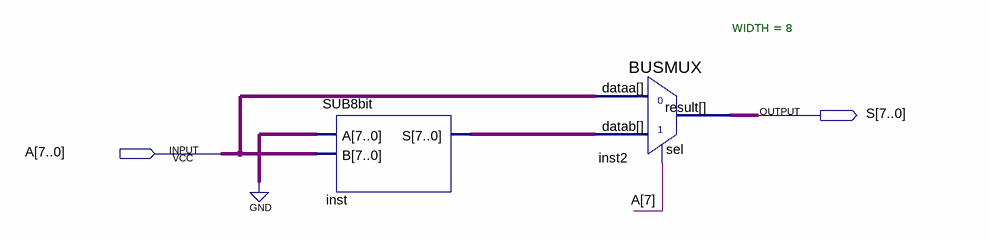
[diagram p0: schematic sheet]
// Quartus schematic Abs.bdf as structural Verilog: 2 symbols, 2 pins
module Abs (
  input  [7:0] A,
  output [7:0] S
);

  wire [7:0] inst_s;

  SUB8bit inst (.A({8{1'b0}}), .B(A), .S(inst_s));
  BUSMUX #(.WIDTH(8)) inst2 (.datab(inst_s), .sel(A[7]), .dataa(A), .result(S));
endmodule
